# EAGLE design piggy (EAGLE 6.4)
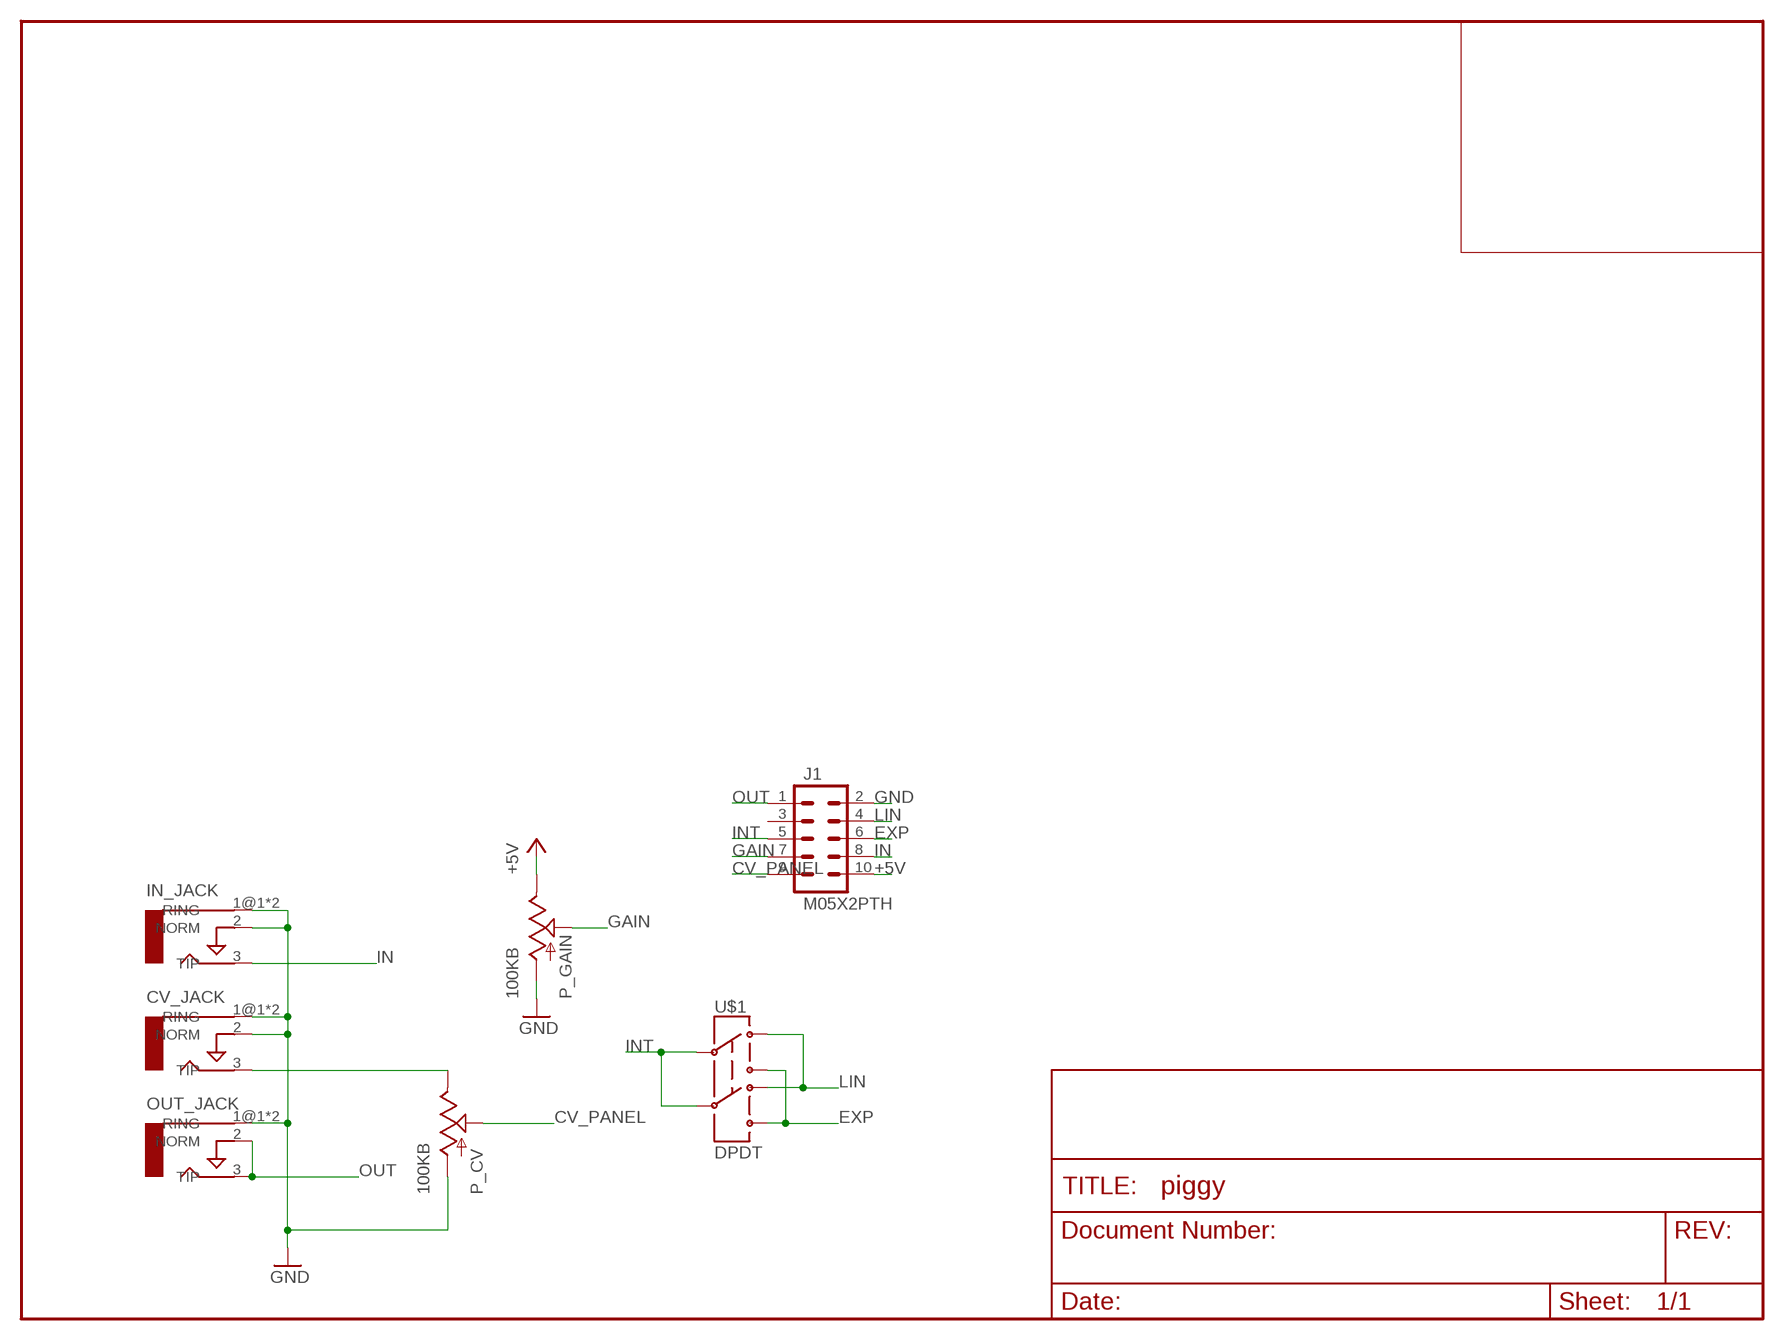
[diagram p0: schematic, sheet 1]

## Parts
CV_JACK  AUDIO-JACKERTHENVAR  [ERTHENVAR-JACK]
IN_JACK  AUDIO-JACKERTHENVAR  [ERTHENVAR-JACK]
J1  M05X2PTH  [AVR_ICSP]
OUT_JACK  AUDIO-JACKERTHENVAR  [ERTHENVAR-JACK]
P_CV  100KB  POTPDB12  [PDB12]
P_GAIN  100KB  POTPDB12  [PDB12]
U$1  DPDT  [MOUNTAIN_10SL005]

## Nets
+5V: J1.10 P_GAIN.3(E)
CV_PANEL: J1.9 P_CV.2(S)
EXP: J1.6 U$1.Y1 U$1.Y2
GAIN: J1.7 P_GAIN.2(S)
GND: CV_JACK.1@1(RING) CV_JACK.1@2(RING) CV_JACK.2(NORM) IN_JACK.1@1(RING) IN_JACK.1@2(RING) IN_JACK.2(NORM) J1.2 OUT_JACK.1@1(RING) OUT_JACK.1@2(RING) P_CV.1(A) P_GAIN.1(A)
IN: IN_JACK.3(TIP) J1.8
INT: J1.5 U$1.C1 U$1.C2
LIN: J1.4 U$1.X1 U$1.X2
N$1: CV_JACK.3(TIP) P_CV.3(E)
OUT: J1.1 OUT_JACK.2(NORM) OUT_JACK.3(TIP)
Unconnected: J1.3

## Library data of the parts
CV_JACK IN_JACK OUT_JACK = erthenvar:AUDIO-JACK: Switching Mono 3.5mm Audio Jack from Erthenvar.
J1 = SparkFun:M05X2: Header 5x2 Standard 10-pin dual row 0.1" header. Commonly used with AVR-ISP. Use with Spark Fun Electronics SKU: PRT-00778
P_CV P_GAIN = SparkFun:POT
U$1 = russruss:DPDT

## Board
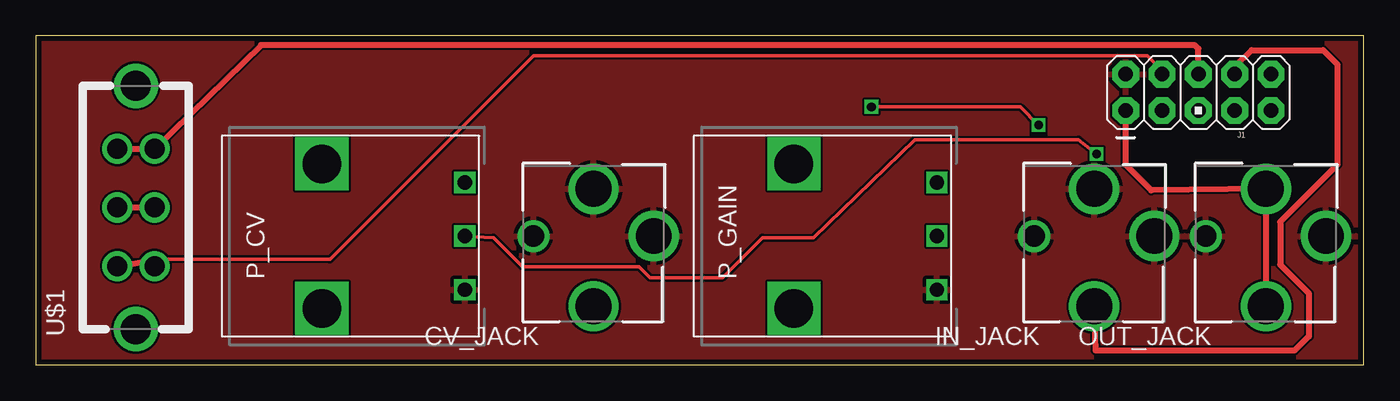
[diagram p1: board, top side]
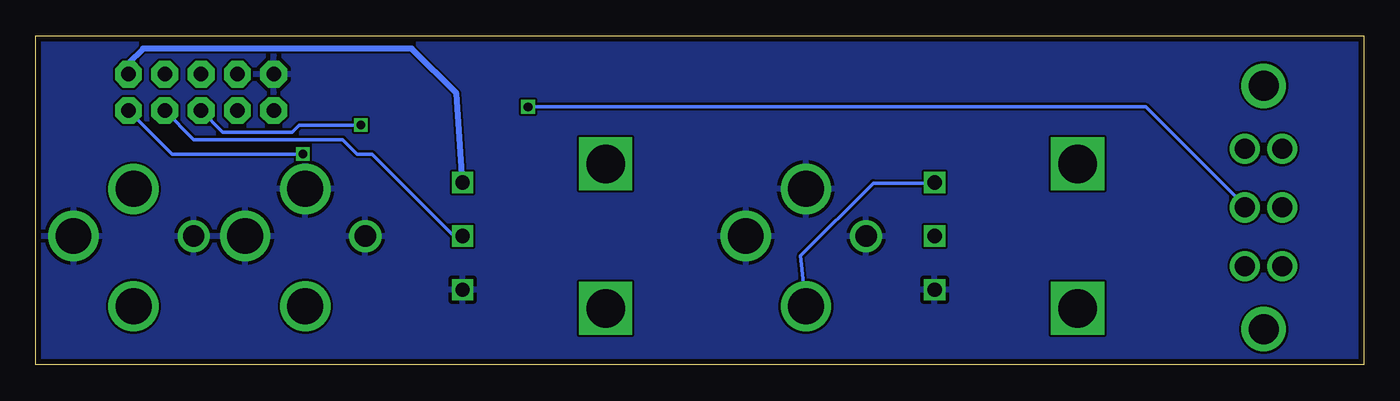
[diagram p2: board, bottom side, seen from below]

Size 92.84 x 23 mm. Coordinates in mm from the lower left corner, seen from the top.
Outline: 0,0 92.84,0 92.84,23 0,23 0,0
Copper layers (1*16): Top 0.0356mm / dielectric 1.5011mm / Bottom 0.0356mm
Design rules "LaenPCBOrder": minimum track width 6mil, minimum drill 13mil, track to track 6mil, track to pad 6mil, pad to pad 6mil, via to via 6mil, smd to smd 6mil, copper to edge 15mil, drill to drill 6mil, minimum pad ring 7mil, minimum via ring 7mil, stop-mask expansion 4mil, vias tented up to drill 0mil, thermal gap 10mil

### Footprints (pad centres in the part's own frame; a part is rotated, then mirrored left to right if it is on the bottom)
ERTHENVAR-JACK = drill 2.5: 1@1 -4.2,0; 2 0,-3.3; 3 0,4.9 | drill 1.5: 1@2 4.2,0
AVR_ICSP = drill 1.016 pad 1.88 octagon: 1 -1.27,5.08; 2 1.27,5.08; 3 -1.27,2.54; 4 1.27,2.54; 5 -1.27,0; 6 1.27,0; 7 -1.27,-2.54; 8 1.27,-2.54; 9 -1.27,-5.08; 10 1.27,-5.08
PDB12 = drill 1 square: 1 -3.75,-10; 2 0,-10; 3 3.75,-10 | drill 2.7 square: P$4 5.05,0; P$5 -5.05,0
MOUNTAIN_10SL005 = drill 1.4: C1 0,1.3; C2 0,-1.3; X1 -4.1,1.3; X2 -4.1,-1.3; Y1 4.1,1.3; Y2 4.1,-1.3 | drill 2.1: GND0 -8.5,0; GND1 8.5,0

### Placement (x,y rotation side)
CV_JACK  39,9 180 top
IN_JACK  74,9 180 top
J1  81.28,19.05 90 top
OUT_JACK  86,9 180 top
P_CV  20,9 90 top
P_GAIN  53,9 90 top
U$1  7,11 90 top

### Tracks (layer width: path | path; a pad name or v marks a point on that pad's centre or on a via)
+5V
  Bottom 0.406: P_GAIN.3 63.42,18.97 66.55,22.1 85.34,22.1 86.36,21.08 J1.10
CV_PANEL  (via drill 0.6)
  Top 0.254: v74.17,14.73 72.9,15.75 61.47,15.75 54.36,8.89 50.8,8.89 48.01,6.1 42.93,6.1 42.16,6.86 34.04,6.86 32,8.89 P_CV.2
  Bottom 0.254: v74.17,14.73 83.31,14.73 J1.9
EXP
  Top 0.406: U$1.Y1 U$1.Y2 15.74,22.35 81.03,22.35 81.28,22.1 J1.6
GAIN
  Bottom 0.254: P_GAIN.2 63.5,8.89 69.34,14.73 70.36,14.73 71.37,15.75 81.79,15.75 J1.7
GND
  pour Top: 0,23 0,0 93,0 93,23
  pour Bottom: 0,23 93,23 93,0 0,0
IN
  Top 0.406: J1.8 83.82,20.82 85,22 90,22 91,21 91,14 87,10 87,7 89,5 89,2 88,1 74.1,1 IN_JACK.3
INT  (via drill 0.6)
  Top 0.254: v58.42,18.03 68.83,18.03 v70.1,16.76
  Top 0.406: U$1.C1 U$1.C2
  Bottom 0.254: U$1.C2 8.92,11.71 15.24,18.03 v58.42,18.03 | v70.1,16.76 74.42,16.76 74.93,16.26 79.76,16.26 J1.5
LIN
  Top 0.254: J1.4 78.74,20.57 77.72,21.59 34.8,21.59 20.57,7.37 8.42,7.37 8.38,7.33
  Top 0.406: U$1.X1 8.38,7.33 U$1.X2
N$1
  Bottom 0.254: CV_JACK.3 39.37,7.62 34.29,12.7 30.46,12.7 P_CV.3
OUT
  Top 0.406: OUT_JACK.3 OUT_JACK.2 77.98,12.19 76.2,13.97 J1.1